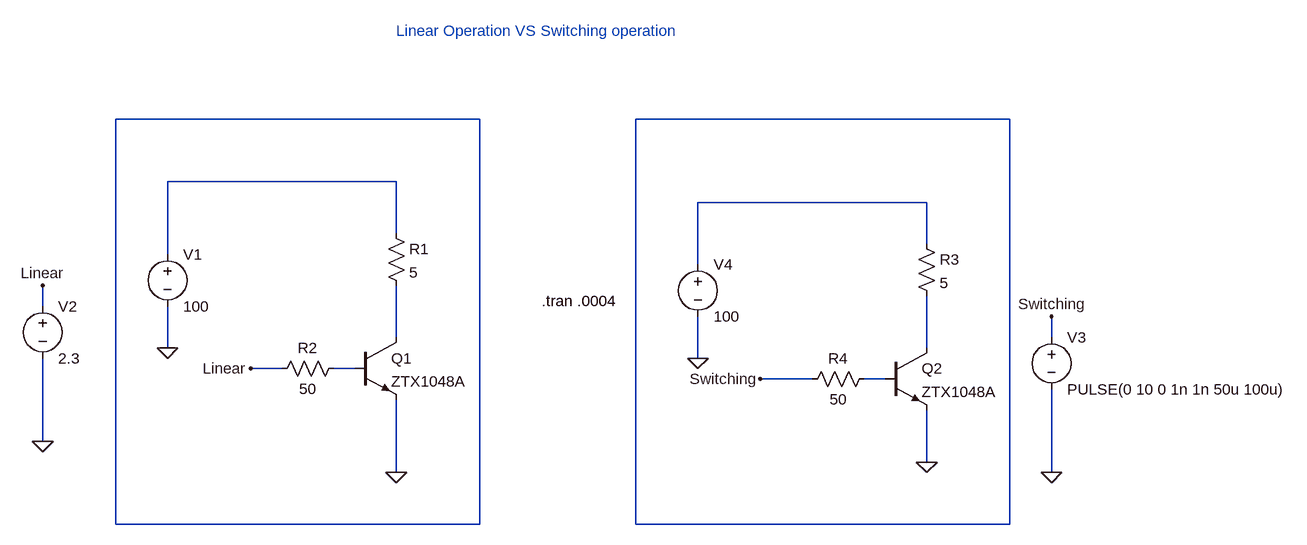
[diagram p0: schematic 01-linearVsSwitchingOperation.asc]
01-linearVsSwitchingOperation.asc, the LTspice schematic file:
Version 4
SHEET 1 1792 680
WIRE 528 -96 -32 -96
WIRE 1344 -96 768 -96
WIRE 400 0 48 0
WIRE 1216 32 864 32
WIRE 400 80 400 0
WIRE 1216 96 1216 32
WIRE 48 112 48 0
WIRE 864 128 864 32
WIRE -144 192 -144 160
WIRE 400 240 400 160
WIRE 1408 240 1408 208
WIRE 48 256 48 192
WIRE 1216 256 1216 176
WIRE 864 272 864 208
WIRE 224 288 176 288
WIRE 336 288 304 288
WIRE 1040 304 960 304
WIRE 1152 304 1120 304
WIRE -144 400 -144 272
WIRE 1216 432 1216 352
WIRE 400 448 400 336
WIRE 1408 448 1408 320
WIRE -32 528 -32 -96
WIRE 528 528 528 -96
WIRE 528 528 -32 528
WIRE 768 528 768 -96
WIRE 1344 528 1344 -96
WIRE 1344 528 768 528
FLAG 48 256 0
FLAG -144 400 0
FLAG 1408 448 0
FLAG 864 272 0
FLAG 400 448 0
FLAG 1216 432 0
FLAG -144 160 Linear
FLAG 176 288 Linear
FLAG 1408 208 Switching
FLAG 960 304 Switching
SYMBOL voltage 48 96 R0
WINDOW 123 0 0 Left 0
WINDOW 39 0 0 Left 0
SYMATTR InstName V1
SYMATTR Value 100
SYMBOL res 384 64 R0
SYMATTR InstName R1
SYMATTR Value 5
SYMBOL npn 336 240 R0
SYMATTR InstName Q1
SYMATTR Value ZTX1048A
SYMBOL res 320 272 R90
WINDOW 0 0 56 VBottom 2
WINDOW 3 32 56 VTop 2
SYMATTR InstName R2
SYMATTR Value 50
SYMBOL voltage -144 176 R0
WINDOW 123 0 0 Left 0
WINDOW 39 0 0 Left 0
SYMATTR InstName V2
SYMATTR Value 2.3
SYMBOL voltage 1408 224 R0
WINDOW 123 0 0 Left 0
WINDOW 39 0 0 Left 0
SYMATTR InstName V3
SYMATTR Value PULSE(0 10 0 1n 1n 50u 100u)
SYMBOL voltage 864 112 R0
WINDOW 123 0 0 Left 0
WINDOW 39 0 0 Left 0
SYMATTR InstName V4
SYMATTR Value 100
SYMBOL res 1200 80 R0
SYMATTR InstName R3
SYMATTR Value 5
SYMBOL npn 1152 256 R0
SYMATTR InstName Q2
SYMATTR Value ZTX1048A
SYMBOL res 1136 288 R90
WINDOW 0 0 56 VBottom 2
WINDOW 3 32 56 VTop 2
SYMATTR InstName R4
SYMATTR Value 50
TEXT 400 -232 Left 2 ;Linear Operation VS Switching operation
TEXT 624 184 Left 2 !.tran .0004

The netlist it stands for:
* 01-linearVsSwitchingOperation.asc
V1 N003 0 100
R1 N003 N005 5
Q1 N005 N007 0 0 ZTX1048A
R2 N007 Linear 50
V2 Linear 0 2.3
V3 Switching 0 PULSE(0 10 0 1n 1n 50u 100u)
V4 N004 0 100
R3 N004 N006 5
Q2 N006 N008 0 0 ZTX1048A
R4 N008 Switching 50
.model NPN NPN
.model PNP PNP
.lib standard.bjt
* Linear Operation VS Switching operation
.tran .0004
.backanno
.end